# EAGLE schematic pH_Arduino (EAGLE 5.10)
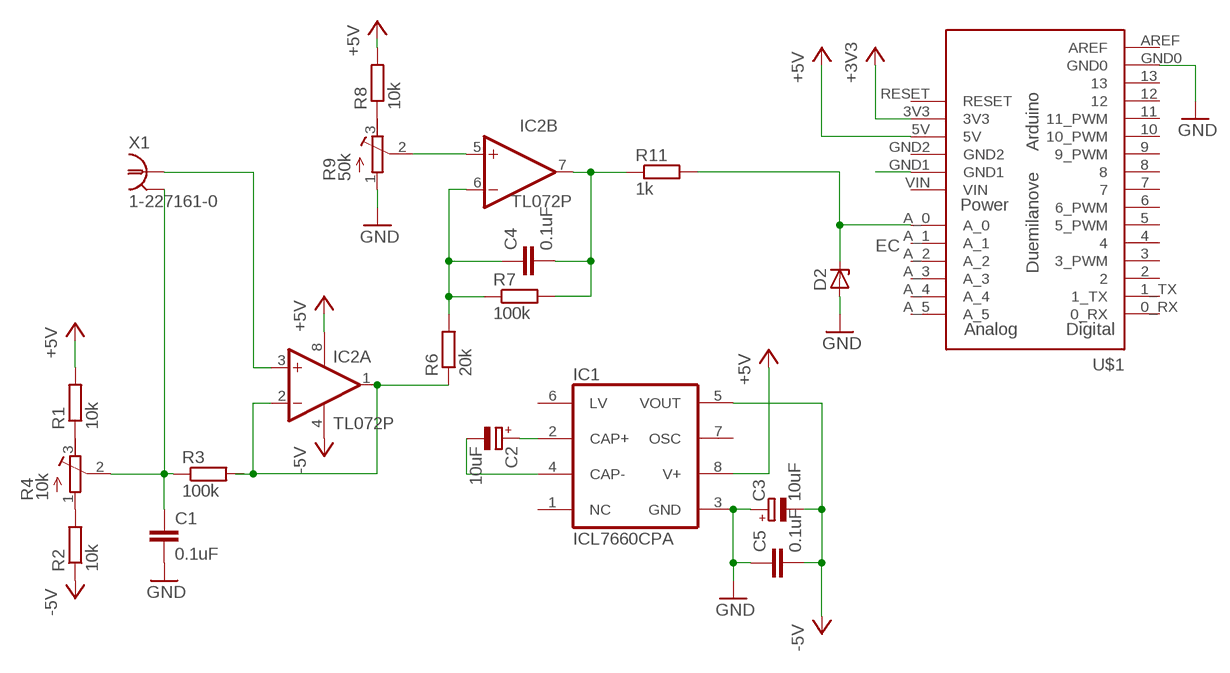
[diagram p0: schematic, sheet 1]

## Parts
C1  0.1uF  C2.5/2  [C2.5-2]
C2  10uF  CPOL-EUE2.5-5  [E2,5-5]
C3  10uF  CPOL-EUE2,5-6E  [E2,5-6E]
C4  0.1uF  C2.5/2  [C2.5-2]
C5  0.1uF  C2.5/2  [C2.5-2]
D2  ZENER-DIODEDO34-7  [DO34Z7]
IC1  ICL7660CPA  [DIL08]
IC2  TL072P  [DIL08]
R1  10k  R-EU_0204/5  [0204/5]
R2  10k  R-EU_0204/5  [0204/5]
R3  100k  R-EU_0204/5  [0204/5]
R4  10k  R-TRIMM64W  [RTRIM64W]
R6  20k  R-EU_0204/5  [0204/5]
R7  100k  R-EU_0204/5  [0204/5]
R8  10k  R-EU_0204/5  [0204/5]
R9  50k  R-TRIMM4G/J  [RTRIM4G/J]
R11  1k  R-EU_0204/5  [0204/5]
U$1  ARDUINO-USBOCTAGONAL_PADS  [SHIELD-OCTAGONALPAD]
X1  1-227161-0  [AMP_227161]

## Nets
+3V3: U$1.3V3
+5V: IC1.8(V+) IC2.8(P:V+) R1.2 R8.2 U$1.5V
-5V: C3.- C5.2 IC1.5(VOUT) IC2.4(P:V-) R2.1
EC: D2.C R11.2 U$1.A_0
GND: C1.2 C3.+ C5.1 D2.A IC1.3(GND) R9.1(E) U$1.GND0
GND1: U$1.GND1
N$1: C1.1 R3.1 R4.2(S) X1.2(GND)
N$2: R1.1 R4.3(A)
N$3: C2.- IC1.4(CAP-)
N$4: IC2.3(A:+IN) X1.1
N$5: R8.1 R9.3(A)
N$7: C4.2 IC2.7(B:OUT) R7.2 R11.1
N$8: R2.2 R4.1(E)
N$10: C2.+ IC1.2(CAP+)
N$11: C4.1 IC2.6(B:-IN) R6.2 R7.1
N$12: IC2.1(A:OUT) IC2.2(A:-IN) R3.2 R6.1
VREF: IC2.5(B:+IN) R9.2(S)
Unconnected: IC1.1(NC) IC1.6(LV) IC1.7(OSC) U$1.0_RX U$1.1_TX U$1.2 U$1.3(3_PWM) U$1.4 U$1.5(5_PWM) U$1.6(6_PWM) U$1.7 U$1.8 U$1.9(9_PWM) U$1.10(10_PWM) U$1.11(11_PWM) U$1.12 U$1.13 U$1.A_1 U$1.A_2 U$1.A_3 U$1.A_4 U$1.A_5 U$1.AREF U$1.GND2 U$1.RESET

## Power pins joined to a net without a drawn wire
VIN: U$1.VIN

## Library data of the parts
C1 C4 C5 = capacitor-wima:C: CAPACITOR naming: grid - package width
C2 C3 = resistor:CPOL-EU: POLARIZED CAPACITOR, European symbol
D2 = diode:ZENER-DIODE: Z-Diode
IC1 = maxim:ICL7660CPA: VOLTAGE CONVERTER
IC2 = linear:TL072: OP AMP
R1-R3 R6-R8 R11 = rcl:R-EU_: RESISTOR, European symbol
R4 R9 = resistor:R-TRIMM: Trimm resistor
U$1 = Arduino-Various:ARDUINO-USB: The Ardiuno Duemilanove Pinouts layoutet as a Bare Shield. v0.5 Also for Arduino Diecimila. This is designed as a Part and has no Outline in the Dimension Layer. The Outline, when present, is drawed at the tPlace / bPlace Layer. Library by Stephanie Lange, http://www.k-ita.de/~sl/
X1 = con-coax:?227161*: JACK, RIGHT ANGLE, 50 OHM, PCB, BNC Source: amp_227161.pdf